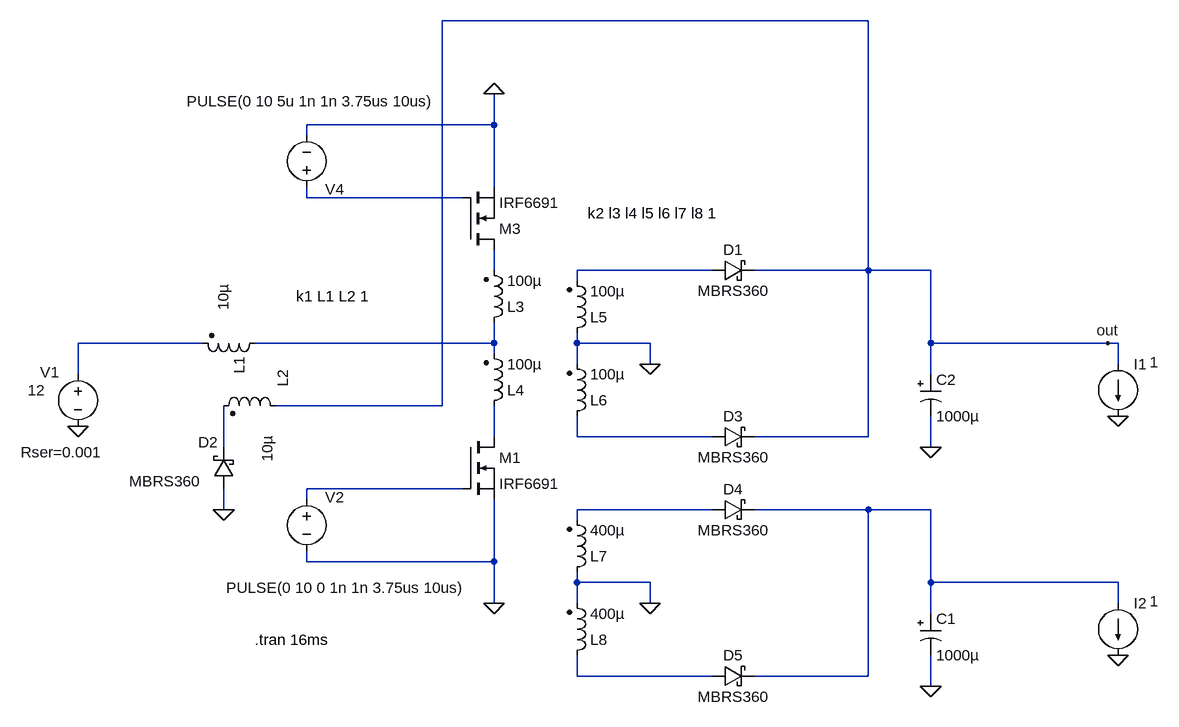
[diagram p0: schematic Input_Inductor_Pushpull.asc]
Input_Inductor_Pushpull.asc, the LTspice schematic file:
Version 4
SHEET 1 2136 900
WIRE 736 -512 80 -512
WIRE 160 -352 160 -400
WIRE 160 -352 -128 -352
WIRE -128 -336 -128 -352
WIRE 160 -256 160 -352
WIRE -128 -240 -128 -256
WIRE 112 -240 -128 -240
WIRE 160 -128 160 -160
WIRE 496 -128 288 -128
WIRE 736 -128 736 -512
WIRE 736 -128 560 -128
WIRE 832 -128 736 -128
WIRE 288 -112 288 -128
WIRE -288 -16 -480 -16
WIRE 160 -16 160 -48
WIRE 160 -16 -208 -16
WIRE 288 -16 288 -32
WIRE 400 -16 288 -16
WIRE 832 -16 832 -128
WIRE 1104 -16 832 -16
WIRE 1120 -16 1104 -16
WIRE 160 0 160 -16
WIRE 288 16 288 -16
WIRE 400 16 400 -16
WIRE 1120 16 1120 -16
WIRE -480 32 -480 -16
WIRE 832 32 832 -16
WIRE 80 80 80 -512
WIRE 80 80 -176 80
WIRE 160 128 160 80
WIRE 288 128 288 96
WIRE 496 128 288 128
WIRE 736 128 736 -128
WIRE 736 128 560 128
WIRE -256 144 -256 80
WIRE 832 144 832 96
WIRE 112 208 -128 208
WIRE -128 224 -128 208
WIRE -256 240 -256 208
WIRE 496 240 288 240
WIRE 736 240 560 240
WIRE 832 240 736 240
WIRE 288 256 288 240
WIRE -128 320 -128 304
WIRE 160 320 160 224
WIRE 160 320 -128 320
WIRE 288 352 288 336
WIRE 400 352 288 352
WIRE 832 352 832 240
WIRE 1120 352 832 352
WIRE 160 384 160 320
WIRE 288 384 288 352
WIRE 400 384 400 352
WIRE 1120 384 1120 352
WIRE 832 400 832 352
WIRE 288 496 288 464
WIRE 496 496 288 496
WIRE 736 496 736 240
WIRE 736 496 560 496
WIRE 832 512 832 464
FLAG 832 144 0
FLAG -480 112 0
FLAG 1120 96 0
FLAG 1104 -16 out
FLAG -256 240 0
FLAG 400 16 0
FLAG 160 -400 0
FLAG 160 384 0
FLAG 400 384 0
FLAG 832 512 0
FLAG 1120 464 0
SYMBOL load2 1120 16 R0
WINDOW 123 0 0 Left 0
WINDOW 39 0 0 Left 0
WINDOW 3 49 -3 Left 0
SYMATTR Value 1
SYMATTR InstName I1
SYMBOL voltage -480 16 R0
WINDOW 3 -77 40 Left 0
WINDOW 123 0 0 Left 0
WINDOW 39 -88 136 Left 0
WINDOW 0 -58 13 Left 0
SYMATTR Value 12
SYMATTR SpiceLine Rser=0.001
SYMATTR InstName V1
SYMBOL polcap 816 32 R0
WINDOW 3 24 64 Left 0
SYMATTR Value 1000µ
SYMATTR InstName C2
SYMATTR Description Capacitor
SYMATTR Type cap
SYMATTR SpiceLine V=63 Rser=0.1 MTBF=1000 Lser=0 ppPkg=1
SYMBOL schottky -240 208 R180
WINDOW 0 24 72 Left 0
WINDOW 3 52 12 Left 0
SYMATTR InstName D2
SYMATTR Value MBRS360
SYMATTR Description Diode
SYMATTR Type diode
SYMBOL voltage -128 208 M0
WINDOW 3 -244 152 Left 0
WINDOW 123 0 0 Left 0
WINDOW 39 -88 136 Left 0
WINDOW 0 -58 13 Left 0
SYMATTR Value PULSE(0 10 0 1n 1n 3.75us 10us)
SYMATTR InstName V2
SYMBOL voltage -128 -240 R180
WINDOW 3 -197 148 Left 0
WINDOW 123 0 0 Left 0
WINDOW 39 -88 136 Left 0
WINDOW 0 -58 13 Left 0
SYMATTR Value PULSE(0 10 5u 1n 1n 3.75us 10us)
SYMATTR InstName V4
SYMBOL ind2 144 -32 M180
SYMATTR InstName L3
SYMATTR Value 100µ
SYMATTR Type ind
SYMATTR SpiceLine Rser=.1
SYMBOL ind2 144 96 M180
SYMATTR InstName L4
SYMATTR Value 100µ
SYMATTR Type ind
SYMATTR SpiceLine Rser=.1
SYMBOL ind2 272 -16 M180
SYMATTR InstName L5
SYMATTR Value 100µ
SYMATTR Type ind
SYMATTR SpiceLine Rser=.1
SYMBOL schottky 496 -112 R270
WINDOW 0 32 32 VTop 0
WINDOW 3 0 32 VBottom 0
SYMATTR InstName D1
SYMATTR Value MBRS360
SYMATTR Description Diode
SYMATTR Type diode
SYMBOL ind2 272 112 M180
SYMATTR InstName L6
SYMATTR Value 100µ
SYMATTR Type ind
SYMATTR SpiceLine Rser=.1
SYMBOL schottky 496 144 R270
WINDOW 0 32 32 VTop 0
WINDOW 3 0 32 VBottom 0
SYMATTR InstName D3
SYMATTR Value MBRS360
SYMATTR Description Diode
SYMATTR Type diode
SYMBOL ind2 -192 -32 R90
WINDOW 3 -75 64 Left 0
SYMATTR Value 10µ
SYMATTR InstName L1
SYMATTR SpiceLine Rser=.001
SYMBOL ind2 -160 96 M270
WINDOW 0 45 5 Left 0
WINDOW 3 -71 29 Left 0
SYMATTR InstName L2
SYMATTR Value 10µ
SYMATTR SpiceLine Rser=0.001
SYMBOL nmos 112 -160 M180
SYMATTR InstName M3
SYMATTR Value IRF6691
SYMBOL nmos 112 128 R0
SYMATTR InstName M1
SYMATTR Value IRF6691
SYMBOL ind2 272 352 M180
SYMATTR InstName L7
SYMATTR Value 400µ
SYMATTR Type ind
SYMATTR SpiceLine Rser=.1
SYMBOL schottky 496 256 R270
WINDOW 0 32 32 VTop 0
WINDOW 3 0 32 VBottom 0
SYMATTR InstName D4
SYMATTR Value MBRS360
SYMATTR Description Diode
SYMATTR Type diode
SYMBOL ind2 272 480 M180
SYMATTR InstName L8
SYMATTR Value 400µ
SYMATTR Type ind
SYMATTR SpiceLine Rser=.1
SYMBOL schottky 496 512 R270
WINDOW 0 32 32 VTop 0
WINDOW 3 0 32 VBottom 0
SYMATTR InstName D5
SYMATTR Value MBRS360
SYMATTR Description Diode
SYMATTR Type diode
SYMBOL load2 1120 384 R0
WINDOW 123 0 0 Left 0
WINDOW 39 0 0 Left 0
WINDOW 3 49 -3 Left 0
SYMATTR Value 1
SYMATTR InstName I2
SYMBOL polcap 816 400 R0
WINDOW 3 24 64 Left 0
SYMATTR Value 1000µ
SYMATTR InstName C1
SYMATTR Description Capacitor
SYMATTR Type cap
SYMATTR SpiceLine V=63 Rser=0.1 MTBF=1000 Lser=0 ppPkg=1
TEXT -208 440 Left 0 !.tran 16ms
TEXT -144 -88 Left 0 !k1 L1 L2 1
TEXT 304 -216 Left 0 !k2 l3 l4 l5 l6 l7 l8 1

The netlist it stands for:
* Input_Inductor_Pushpull.asc
I1 out 0 1
V1 N004 0 12 Rser=0.001
C2 out 0 1000µ V=63 Rser=0.1 MTBF=1000 Lser=0 ppPkg=1
D2 0 N008 MBRS360
V2 N009 0 PULSE(0 10 0 1n 1n 3.75us 10us)
V4 N001 0 PULSE(0 10 5u 1n 1n 3.75us 10us)
L3 N005 N002 100µ Rser=.1
L4 N006 N005 100µ Rser=.1
L5 0 N003 100µ Rser=.1
D1 N003 out MBRS360
L6 N007 0 100µ Rser=.1
D3 N007 out MBRS360
L1 N005 N004 10µ Rser=.001
L2 out N008 10µ Rser=0.001
M3 N002 N001 0 0 IRF6691
M1 N006 N009 0 0 IRF6691
L7 0 N010 400µ Rser=.1
D4 N010 N011 MBRS360
L8 N012 0 400µ Rser=.1
D5 N012 N011 MBRS360
I2 N011 0 1
C1 N011 0 1000µ V=63 Rser=0.1 MTBF=1000 Lser=0 ppPkg=1
.model D D
.lib standard.dio
.model NMOS NMOS
.model PMOS PMOS
.lib standard.mos
.tran 16ms
k1 L1 L2 1
k2 l3 l4 l5 l6 l7 l8 1
.backanno
.end